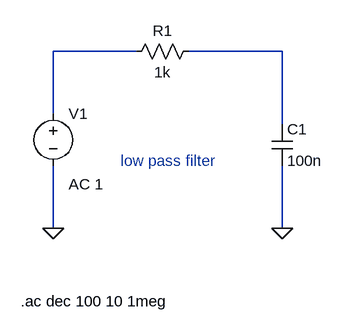
[diagram p0: schematic LowPassFilter.asc]
LowPassFilter.asc, the LTspice schematic file:
Version 4
SHEET 1 880 680
WIRE 176 -32 48 -32
WIRE 400 -32 256 -32
WIRE 48 64 48 -32
WIRE 400 80 400 -32
WIRE 48 240 48 144
WIRE 400 240 400 144
FLAG 48 240 0
FLAG 400 240 0
SYMBOL voltage 48 48 R0
WINDOW 123 24 124 Left 2
WINDOW 39 0 0 Left 0
SYMATTR InstName V1
SYMATTR Value ""
SYMATTR Value2 AC 1
SYMBOL res 272 -48 R90
WINDOW 0 0 56 VBottom 2
WINDOW 3 32 56 VTop 2
SYMATTR InstName R1
SYMATTR Value 1k
SYMBOL cap 384 80 R0
SYMATTR InstName C1
SYMATTR Value 100n
TEXT -2 352 Left 2 !.ac dec 100 10 1meg
TEXT 152 136 Left 2 ;low pass filter

The netlist it stands for:
* LowPassFilter.asc
V1 N001 0 AC 1
R1 N002 N001 1k
C1 N002 0 100n
.ac dec 100 10 1meg
* low pass filter
.backanno
.end